# EAGLE design Luminode_Controller_Mark_I (EAGLE 6.6.0)
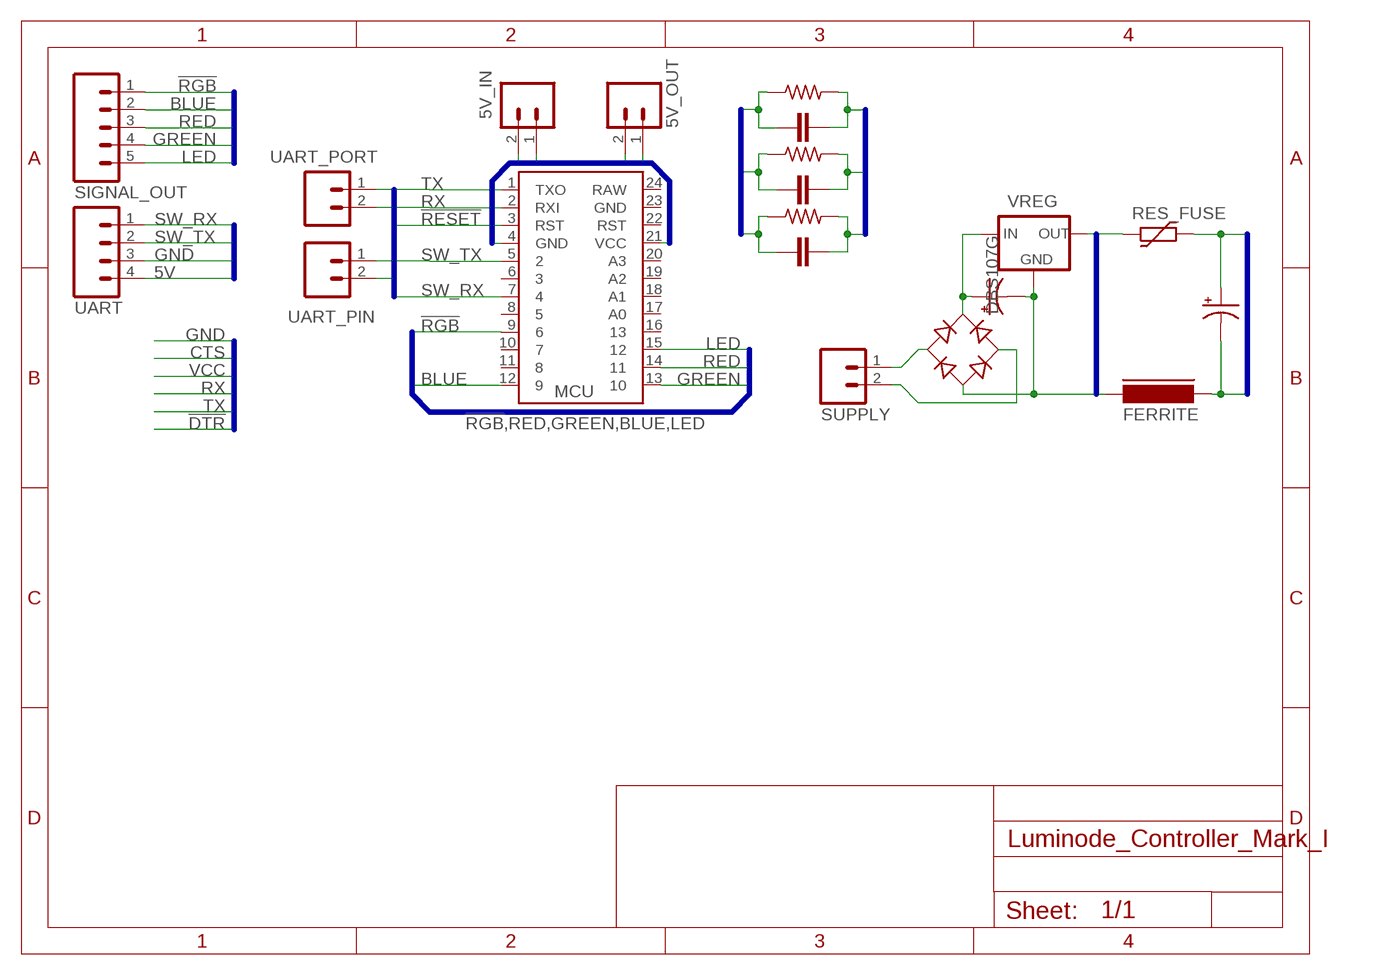
[diagram p0: schematic, sheet 1]

## Parts
5V_IN  M02PTH  [1X02]
5V_OUT  M02PTH  [1X02]
C_BLUE  C-EUC0805K  [C0805K]
C_GREEN  C-EUC0805K  [C0805K]
C_IN  CPOL-USSMCB  [SMC_B]
C_OUT  CPOL-USSMCB  [SMC_B]
C_RED  C-EUC0805K  [C0805K]
FERRITE  FERRITE-0805  [FB805]
MCU  ARDUINO_MINI  [ARDUINO_MINI]
R_BLUE  R-US_M1206  [M1206]
R_GREEN  R-US_M1206  [M1206]
R_RED  R-US_M1206  [M1206]
RECTIFIER  DBS107G  [DBS]
RES_FUSE  FUSE_PTC-0805  [PTC0805]
SIGNAL_OUT  M05PTH  [1X05]
SUPPLY  M02PTH  [1X02]
UART  M04PTH  [1X04]
UART_PIN  M02PTH  [1X02]
UART_PORT  M02PTH  [1X02]
VREG  7805  LM1117  [SOT223]

## Nets
5V: 5V_IN.1 5V_OUT.1 C_OUT.+ MCU.21(VCC) RES_FUSE.2 UART.4
!RESET: MCU.3(RST)
!RGB: MCU.9 SIGNAL_OUT.1
AC_EARTH [SUPPLY]: RECTIFIER.AC2 SUPPLY.2
AC_IN [SUPPLY]: RECTIFIER.AC1 SUPPLY.1
BLUE: C_BLUE.2 MCU.12 R_BLUE.1 SIGNAL_OUT.2
EARTH: C_IN.- FERRITE.2 RECTIFIER.- VREG.1(GND)
GND [SUPPLY]: 5V_IN.2 5V_OUT.2 C_BLUE.1 C_GREEN.1 C_OUT.- C_RED.1 FERRITE.1 MCU.4(GND) R_BLUE.2 R_GREEN.2 R_RED.2 UART.3
GREEN: C_GREEN.2 MCU.13 R_GREEN.1 SIGNAL_OUT.4
LED: MCU.15 SIGNAL_OUT.5
RED: C_RED.2 MCU.14 R_RED.1 SIGNAL_OUT.3
RX: MCU.2(RXI)
SW_RX: MCU.7 UART.1 UART_PIN.2 UART_PORT.2
SW_TX: MCU.5 UART.2 UART_PIN.1 UART_PORT.1
TX: MCU.1(TXO)
VIN: C_IN.+ RECTIFIER.+ VREG.3(IN)
VOUT: RES_FUSE.1 VREG.2(OUT)
Unconnected: MCU.6 MCU.8 MCU.10 MCU.11 MCU.16 MCU.17(A0) MCU.18(A1) MCU.19(A2) MCU.20(A3) MCU.22(RST) MCU.23(GND) MCU.24(RAW)

## Buses
GND
RED,GREEN,BLUE
5V,GND
TX,RX,!RESET,SW_TX,SW_RX
!RGB,RED,GREEN,BLUE,LED
SW_RX,SW_TX,GND,VCC
!DTR,RX,TX,VCC,CTS,GND
VOUT,EARTH

## Library data of the parts
5V_IN 5V_OUT SUPPLY UART_PIN UART_PORT = SparkFun:M02: Header 2 Standard 2-pin 0.1" header. Use with straight break away headers (SKU : PRT-00116), right angle break away headers (PRT-00553), swiss pins (PRT-00743), machine pins (PRT-00117), and female headers (PRT-00115). Molex polarized connector foot print use with SKU : PRT-08233 with associated crimp pins and housings.
C_BLUE C_GREEN C_RED = rcl:C-EU: CAPACITOR, European symbol
C_IN C_OUT = rcl:CPOL-US: POLARIZED CAPACITOR, American symbol
FERRITE = dp_devices:FERRITE: Ferrite bead in various packages
MCU = SparkFun-Boards:ARDUINO_MINI: Arduino Pro Mini footprint
R_BLUE R_GREEN R_RED = rcl:R-US_: RESISTOR, American symbol
RECTIFIER = rectifier:DB?*G: Single Phase 1.0 AMP Glass Passivated Bridge Rectifier Taiwan Semiconductor Co.,Ltd. - TSC Source: http://www.taiwansemi.com/TSCbig5/ezcatfiles/cust/img/img/db101g.pdf http://www.ts.com.tw/db/pictures/modules/PDT/PDT060207001/DBLS201G.pdf
RES_FUSE = dp_devices:FUSE_PTC: Resettable PTC
SIGNAL_OUT = SparkFun:M05: Header 5 Standard 5-pin 0.1" header. Use with straight break away headers (SKU : PRT-00116), right angle break away headers (PRT-00553), swiss pins (PRT-00743), machine pins (PRT-00117), and female headers (PRT-00115). Molex polarized connector foot print use with SKU : PRT-08230 with associated crimp pins and housings.
UART = SparkFun:M04: Header 4 Standard 4-pin 0.1" header. Use with straight break away headers (SKU : PRT-00116), right angle break away headers (PRT-00553), swiss pins (PRT-00743), machine pins (PRT-00117), and female headers (PRT-00115). Molex polarized connector foot print use with SKU : PRT-08231 with associated crimp pins and housings.
VREG = v-reg-2:LM1117

## Net classes
0 default: width 0.508 mm, clearance 0.508 mm
1 HIGH CURRENT: width 0.61 mm, clearance 0.61 mm
3 SUPPLY: width 0.813 mm, drill 0.61 mm, clearance 0.61 mm

## Board
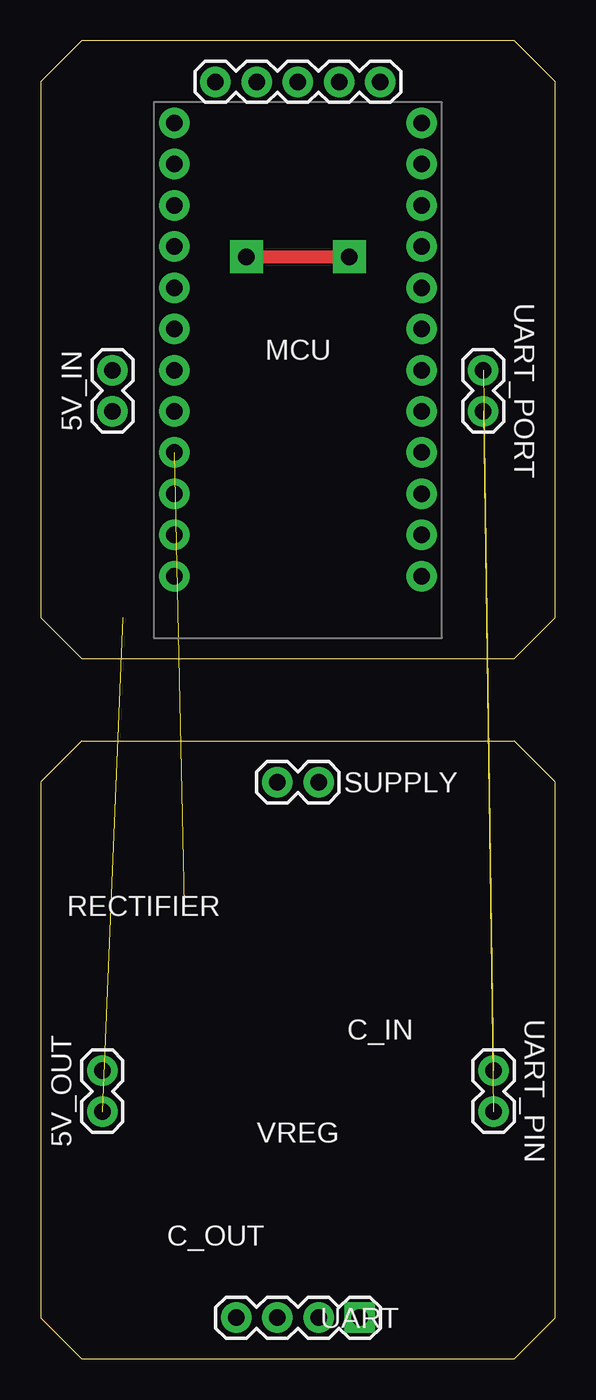
[diagram p1: board, top side]
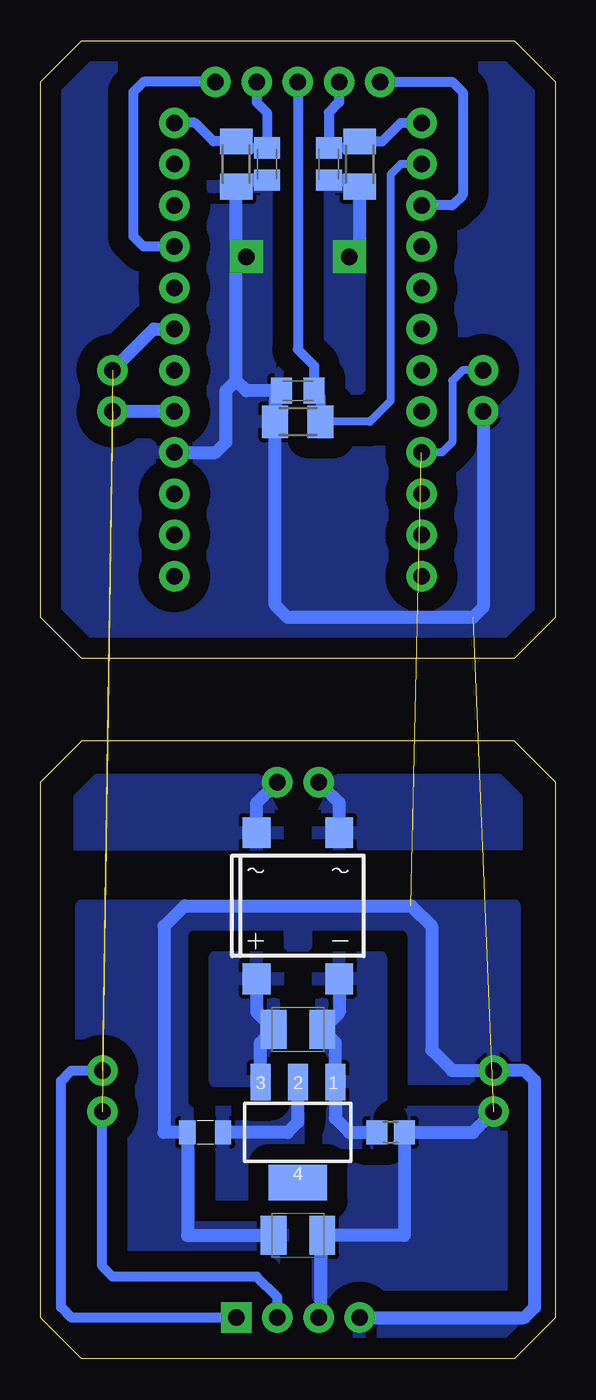
[diagram p2: board, bottom side, seen from below]

Size 31.75 x 81.28 mm. Coordinates in mm from the lower left corner, seen from the top.
Outline: 2.54,43.18 29.21,43.18 31.75,45.72 31.75,78.74 29.21,81.28 2.54,81.28 0,78.74 0,45.72 2.54,43.18
Outline: 2.54,0 29.21,0 31.75,2.54 31.75,35.56 29.21,38.1 2.54,38.1 0,35.56 0,2.54 2.54,0
Copper layers (1*16): Top 0.035mm / dielectric 1.5mm / Bottom 0.035mm
Design rules "default *": minimum track width 10mil, minimum drill 24mil, track to track 8mil, track to pad 8mil, pad to pad 8mil, via to via 8mil, smd to smd 8mil, copper to edge 40mil, drill to drill 8mil, minimum pad ring 10mil, minimum via ring 8mil, stop-mask expansion 4mil, vias tented up to drill 0mil, thermal gap 10mil

### Footprints (pad centres in the part's own frame; a part is rotated, then mirrored left to right if it is on the bottom)
1X02 = drill 1.016 pad 1.88: 1 0,0; 2 2.54,0
C0805K = smd 1.3 x 1.6: 1 -1,0; 2 1,0
SMC_B = smd 1.6 x 2.4: + -1.5,0; - 1.5,0
FB805 = smd 1.3 x 1.5: 1 -0.85,0; 2 0.85,0
ARDUINO_MINI = drill 1.016 pad 1.88: 1 -7.62,12.7; 2 -7.62,10.16; 3 -7.62,7.62; 4 -7.62,5.08; 5 -7.62,2.54; 6 -7.62,0; 7 -7.62,-2.54; 8 -7.62,-5.08; 9 -7.62,-7.62; 10 -7.62,-10.16; 11 -7.62,-12.7; 12 -7.62,-15.24; 13 7.62,-15.24; 14 7.62,-12.7; 15 7.62,-10.16; 16 7.62,-7.62; 17 7.62,-5.08; 18 7.62,-2.54; 19 7.62,0; 20 7.62,2.54; 21 7.62,5.08; 22 7.62,7.62; 23 7.62,10.16; 24 7.62,12.7
M1206 = smd 1.6 x 2: 1 -1.4,0; 2 1.4,0
DBS = smd 1.7 x 1.9: + -2.55,-4.5; - 2.55,-4.5; AC1 -2.55,4.5; AC2 2.55,4.5
PTC0805 = smd 1 x 1.5: 1 -1.1,0; 2 1.1,0
1X05 = drill 1.016 pad 1.88: 1 0,0; 2 2.54,0; 3 5.08,0; 4 7.62,0; 5 10.16,0
1X04 = drill 1.016 pad 1.88 square: 1 0,0 | drill 1.016 pad 1.88: 2 2.54,0; 3 5.08,0; 4 7.62,0
SOT223 = smd 1.219 x 2.235: 1 -2.311,-3.099; 2 0,-3.099; 3 2.311,-3.099 | smd 3.6 x 2.2: 4 0,3.099

### Placement (x,y rotation side)
5V_IN  4.45,60.96 270 top
5V_OUT  3.81,17.78 270 top
C_BLUE  17.78,73.66 90 bottom
C_GREEN  13.97,73.66 90 bottom
C_IN  15.88,20.32 0 bottom
C_OUT  15.88,7.62 0 bottom
C_RED  15.88,59.69 0 bottom
FERRITE  10.16,13.97 180 bottom
MCU  15.88,60.96 180 top
R_BLUE  19.68,73.66 270 bottom
R_GREEN  12.06,73.66 270 bottom
R_RED  15.88,57.78 180 bottom
RECTIFIER  15.88,27.94 0 bottom
RES_FUSE  21.59,13.97 180 bottom
SIGNAL_OUT  20.95,78.74 180 top
SUPPLY  17.14,35.56 180 top
UART  19.68,2.54 180 top
UART_PIN  27.94,15.24 90 top
UART_PORT  27.3,58.42 90 top
VREG  15.88,13.97 180 bottom

### Tracks (layer width: path | path; a pad name or v marks a point on that pad's centre or on a via)
5V  (1 unrouted)
  Bottom 0.508: 5V_IN.1 5.71,60.96 6.35,60.33 6.35,56.52 6.98,55.88 MCU.21 | 3.56,17.78 5V_OUT.1
  Bottom 0.813: UART.4 1.91,2.54 1.27,3.17 1.27,17.14 1.91,17.78 5V_OUT.1 6.35,17.78 7.62,19.05 7.62,26.67 8.89,27.94 22.86,27.94 24.13,26.67 24.13,13.97 RES_FUSE.2 22.69,7.62 C_OUT.+
  pour Bottom (isolate 1.27, rank 2): 2.54,27.94 2.54,0 29.21,0 29.21,27.94
!RGB
  Bottom 0.61: SIGNAL_OUT.1 25.4,78.74 26.03,78.11 26.03,69.22 25.4,68.58 MCU.9
AC_EARTH
  Bottom 0.813: RECTIFIER.AC2 13.32,34.28 SUPPLY.2
  pour Bottom (isolate 2.032): 0,31.75 14.61,31.75 14.61,38.1 2.54,38.1 0,35.56
AC_IN
  Bottom 0.813: RECTIFIER.AC1 18.42,34.28 SUPPLY.1
  pour Bottom (isolate 2.032): 31.75,31.75 17.14,31.75 17.14,38.1 29.21,38.1 31.75,35.56
BLUE
  Bottom 0.61: SIGNAL_OUT.2 18.41,77.47 17.78,76.84 C_BLUE.2 19.28,74.66 R_BLUE.1 21.09,75.06 22.23,76.2 MCU.12
EARTH
  Bottom 0.813: RECTIFIER.- 13.32,21.37 C_IN.- 13.56,19.51 VREG.1 13.56,14.83 12.7,13.97 FERRITE.2
  pour Bottom (isolate 1.27): 10.79,24.77 10.79,13.34 14.61,13.34 14.61,24.77
GND  (via drill 1.02 pad 2.03)  (1 unrouted)
  Top 0.813: v12.7,67.94 v19.05,67.94
  Bottom 0.813: 19.68,60.33 19.05,59.69 C_RED.1 17.27,59.29 R_RED.2 17.27,46.48 16.51,45.72 5.08,45.72 4.45,46.36 5V_IN.2 | C_BLUE.1 19.28,72.66 R_BLUE.2 19.68,68.58 v19.05,67.94 19.68,67.31 19.68,60.33 | C_GREEN.1 12.46,72.66 R_GREEN.2 12.06,68.58 v12.7,67.94 | 19.68,60.33 20.32,59.69 20.32,56.52 20.95,55.88 MCU.4 | UART.3 14.48,2.54 14.48,7.37 C_OUT.- 9.31,7.62 FERRITE.1 5.08,13.97 5V_OUT.2
  pour Bottom (isolate 1.27): 0,45.72 2.54,43.18 29.21,43.18 31.75,45.72 31.75,78.74 29.21,81.28 2.54,81.28 0,78.74
  pour Bottom (isolate 1.27): 2.54,3.81 14.61,3.81 14.61,12.07 9.52,12.07 9.52,15.24 2.54,15.24
GREEN
  Bottom 0.61: SIGNAL_OUT.4 13.34,77.47 13.97,76.84 C_GREEN.2 12.46,74.66 R_GREEN.1 10.66,75.06 9.52,76.2 MCU.13
LED
  Bottom 0.61: SIGNAL_OUT.5 6.35,78.74 5.71,78.11 5.71,71.75 6.35,71.12 MCU.15
RED
  Bottom 0.508: MCU.14 9.52,73.66 10.16,73.03 10.16,59.05 11.43,57.78 R_RED.1
  Bottom 0.61: SIGNAL_OUT.3 15.88,62.23 14.88,61.23 C_RED.2 14.47,59.29 R_RED.1
SW_RX  (1 unrouted)
  Bottom 0.61: UART.1 29.84,2.54 30.48,3.17 30.48,17.14 29.84,17.78 UART_PIN.2
  Bottom 0.813: UART_PORT.2 24.77,63.5 MCU.7
SW_TX  (1 unrouted)
  Bottom 0.61: UART.2 17.14,3.81 18.41,5.08 27.3,5.08 27.94,5.72 UART_PIN.1
  Bottom 0.813: UART_PORT.1 MCU.5
VIN
  Bottom 0.813: RECTIFIER.+ 18.42,21.37 C_IN.+ 18.19,19.51 VREG.3
  pour Bottom (isolate 1.27): 17.14,24.77 17.14,17.14 20.95,17.14 20.95,24.77
VOUT
  Bottom 0.813: VREG.2 15.88,14.61 16.51,13.97 RES_FUSE.1
  pour Bottom (isolate 1.27): 15.88,15.24 15.88,10.16 20.95,10.16 20.95,15.24